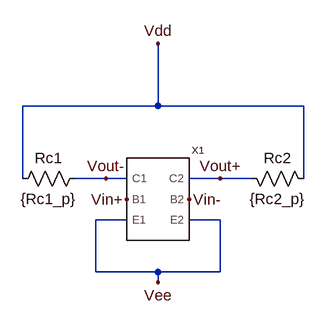
[diagram p0: schematic long_tailed_pair.asc]
long_tailed_pair.asc, the LTspice schematic file:
Version 4.1
SHEET 1 1140 680
WIRE 208 32 208 -64
WIRE 208 32 0 32
WIRE 432 32 208 32
WIRE 0 144 0 32
WIRE 128 144 80 144
WIRE 160 144 128 144
WIRE 304 144 256 144
WIRE 352 144 304 144
WIRE 432 144 432 32
WIRE 160 208 112 208
WIRE 304 208 256 208
WIRE 112 288 112 208
WIRE 208 288 112 288
WIRE 304 288 304 208
WIRE 304 288 208 288
WIRE 208 304 208 288
FLAG 208 -64 Vdd
FLAG 160 176 Vin+
FLAG 256 176 Vin-
FLAG 208 304 Vee
FLAG 128 144 Vout-
FLAG 304 144 Vout+
SYMBOL res 96 128 R90
WINDOW 0 0 56 VBottom 2
WINDOW 3 32 56 VTop 2
SYMATTR InstName Rc1
SYMATTR Value {Rc1_p}
SYMBOL res 336 128 M90
WINDOW 0 0 56 VBottom 2
WINDOW 3 32 56 VTop 2
SYMATTR InstName Rc2
SYMATTR Value {Rc2_p}
SYMBOL BCM847BS_pair 224 176 R0
SYMATTR InstName X1

The netlist it stands for:
* long_tailed_pair.asc
Rc1 Vout- Vdd {Rc1_p}
Rc2 Vout+ Vdd {Rc2_p}
X§X1 Vout- Vin+ Vee Vout+ Vin- Vee BCM847BS_pair  ; pins C1 B1 E1 C2 B2 E2
.backanno
.end